# EasyEDA schematic glass-suction.json
TITLE: Glass Suction Machine; REV: 1.0; Date: 2023-12-04; Sheet: 1/1; Company: Zydex
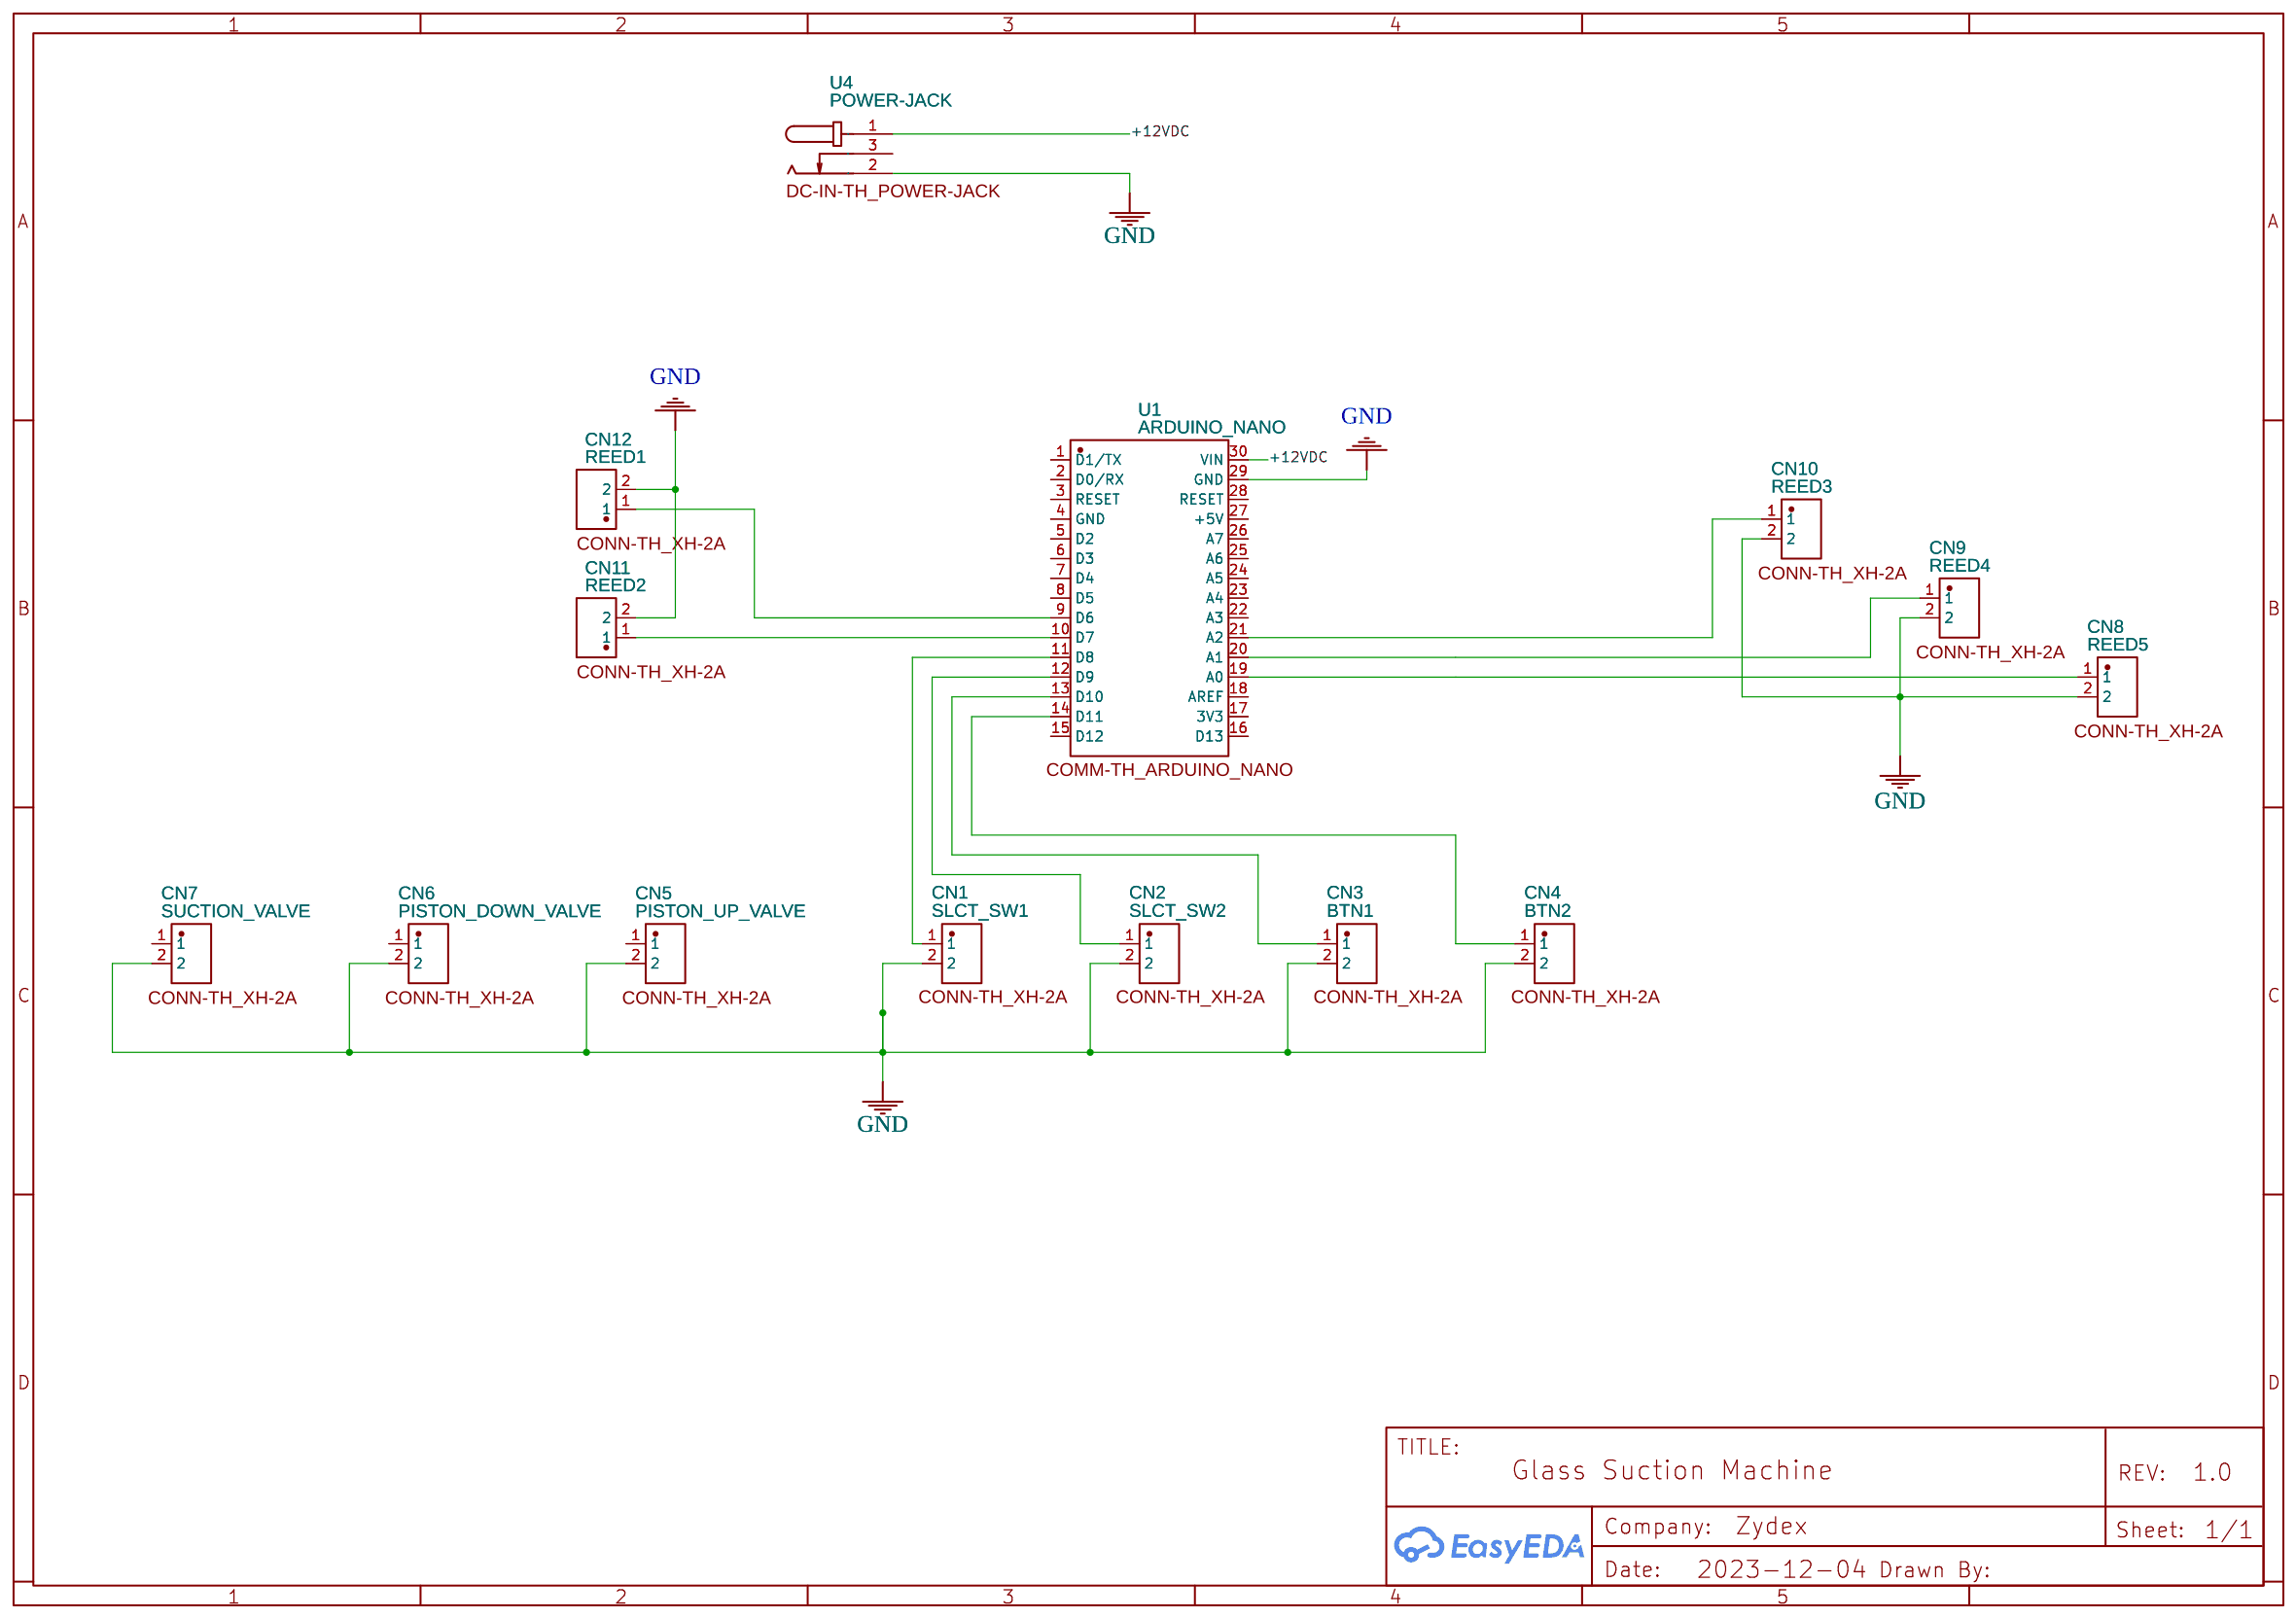
[diagram p0: schematic sheet]

## Parts
CN1  SLCT_SW1  [CONN-TH_XH-2A]
CN2  SLCT_SW2  [CONN-TH_XH-2A]
CN3  BTN1  [CONN-TH_XH-2A]
CN4  BTN2  [CONN-TH_XH-2A]
CN5  PISTON_UP_VALVE  [CONN-TH_XH-2A]
CN6  PISTON_DOWN_VALVE  [CONN-TH_XH-2A]
CN7  SUCTION_VALVE  [CONN-TH_XH-2A]
CN8  REED5  [CONN-TH_XH-2A]
CN9  REED4  [CONN-TH_XH-2A]
CN10  REED3  [CONN-TH_XH-2A]
CN11  REED2  [CONN-TH_XH-2A]
CN12  REED1  [CONN-TH_XH-2A]
U1  ARDUINO_NANO  [COMM-TH_ARDUINO_NANO]
U4  POWER-JACK  [DC-IN-TH_POWER-JACK]

## Library data of the parts
CN1-CN12 = XH2.54-2A: Contributor: LCSC; Supplier: LCSC; Supplier Part: C9900000596; Manufacturer: null; JLCPCB Part Class: Extended Part; link: https://lcsc.com/eda_search?q=C9900000596&%26type=1&ref=editor; Package Display: Yes
U1 = ARDUINO_NANO: Contributor: lcsc; Supplier: LCSC; Supplier Part: C9900017879; Manufacturer: null; JLCPCB Part Class: Extended Part; link: https://lcsc.com/eda_search?q=C9900017879&%26type=1&ref=editor; Package Display: Yes
U4 = POWER-JACK: Contributor: LCSC; Supplier: LCSC; Supplier Part: C9900001795; Manufacturer: 索峰; JLCPCB Part Class: Extended Part; link: https://lcsc.com/eda_search?q=C9900001795&%26type=1&ref=editor; Package Display: Yes

## Nets
+12VDC: U1.30(VIN) U4.1
GND: CN1.2 CN2.2 CN3.2 CN4.2 CN5.2 CN6.2 CN7.2 CN8.2 CN9.2 CN10.2 CN11.2 CN12.2 U1.29(GND) U4.2
Net-(CN1-1): CN1.1 U1.11(D8)
Net-(CN2-1): CN2.1 U1.12(D9)
Net-(CN3-1): CN3.1 U1.13(D10)
Net-(CN4-1): CN4.1 U1.14(D11)
Net-(CN8-1): CN8.1 U1.19(A0)
Net-(CN9-1): CN9.1 U1.20(A1)
Net-(CN10-1): CN10.1 U1.21(A2)
Net-(CN11-1): CN11.1 U1.10(D7)
Net-(CN12-1): CN12.1 U1.9(D6)

Not connected (* = marked no-connect by the designer): CN5 1; CN6 1; CN7 1; U1 1(D1/TX) 2(D0/RX) 3(RESET) 4(GND) 5(D2) 6(D3) 7(D4) 8(D5) 15(D12) 16(D13) 17(3V3) 18(AREF) 22(A3) 23(A4) 24(A5) 25(A6) 26(A7) 27(+5V) 28(RESET); U4 3
